# EAGLE design breakout (EAGLE 9.6.2)
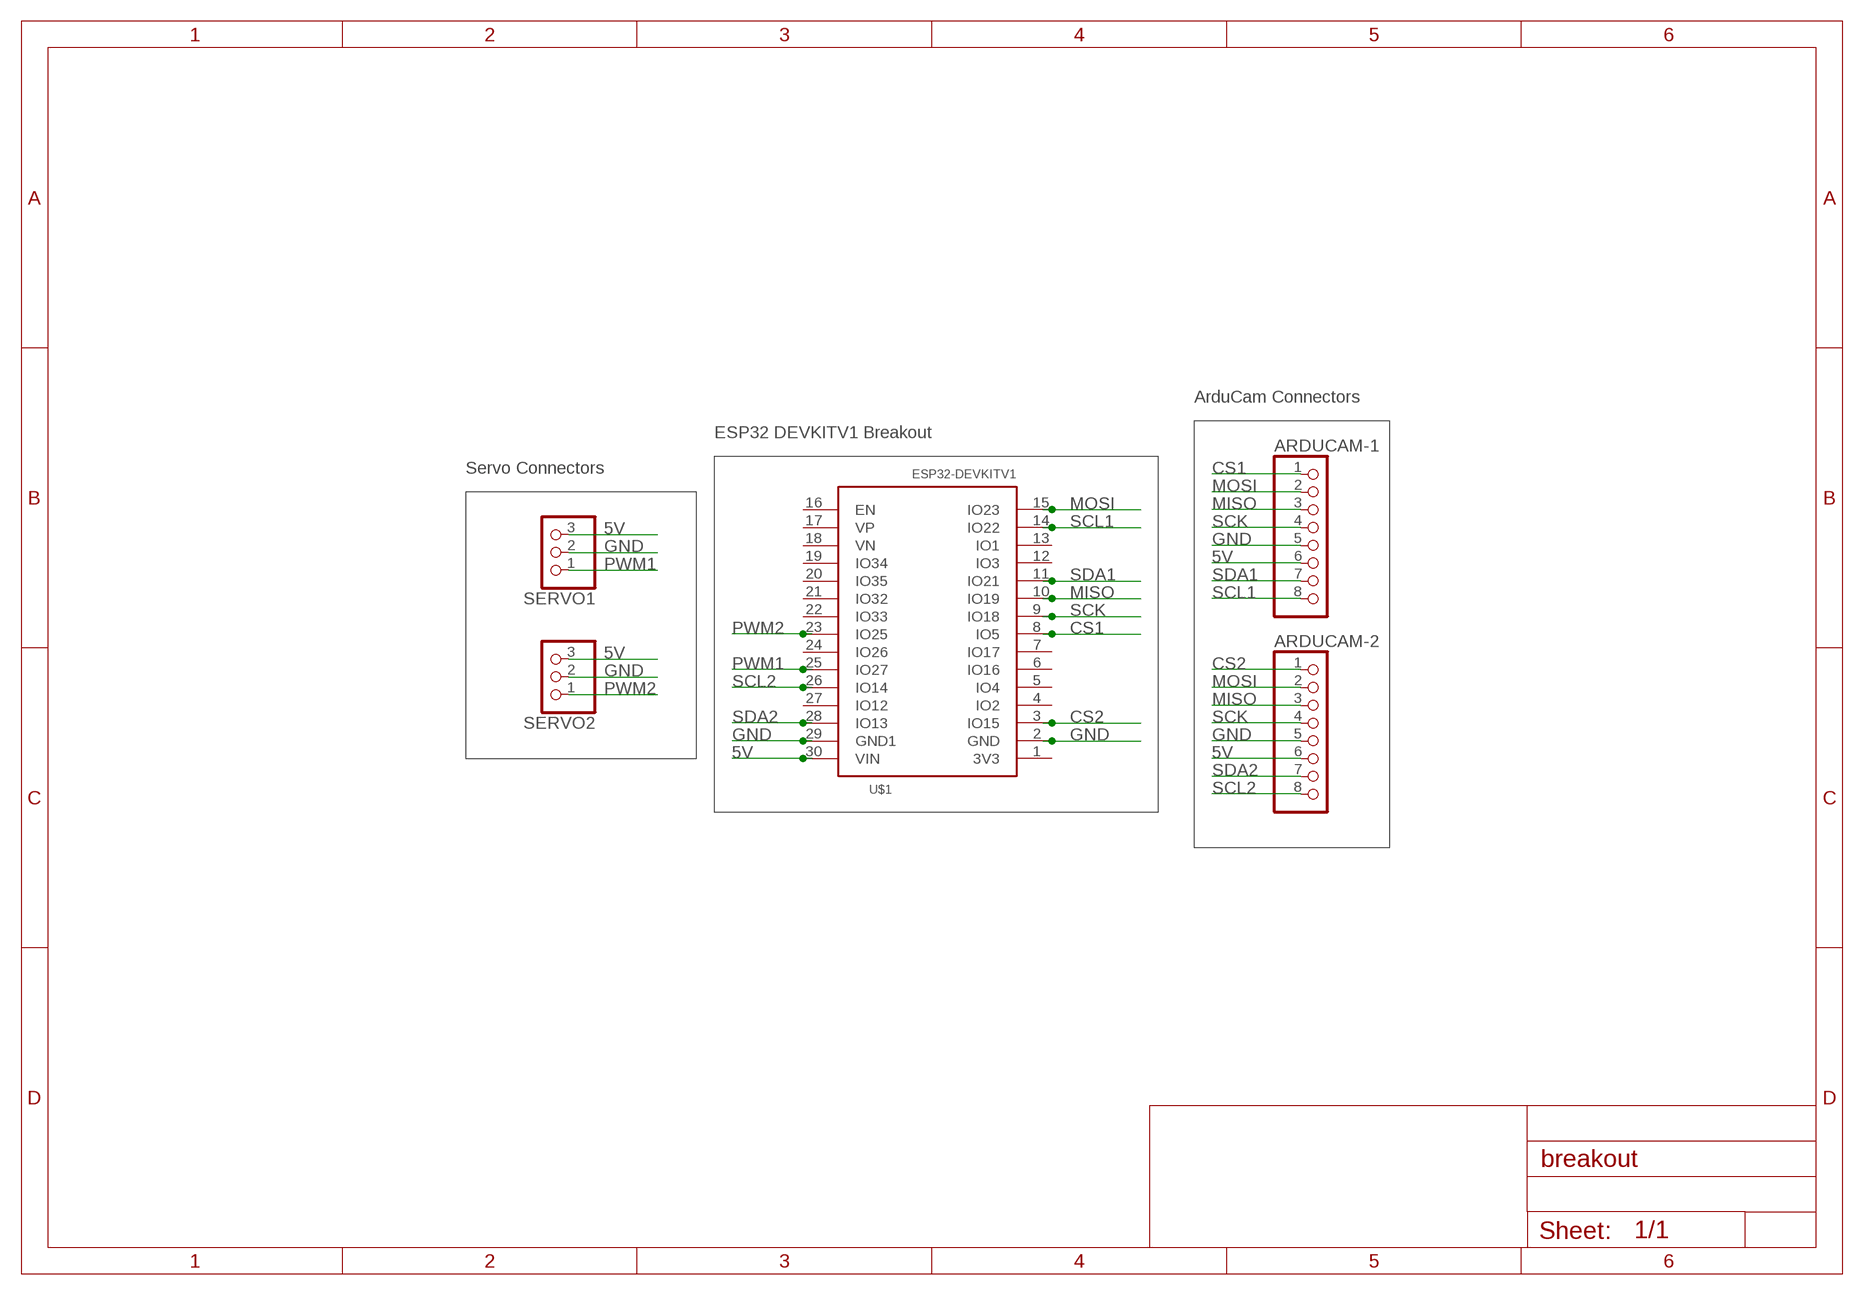
[diagram p0: schematic, sheet 1]

## Parts
ARDUCAM-1  PINHD-1X8BIG  [1X08-BIG]
ARDUCAM-2  PINHD-1X8BIG  [1X08-BIG]
SERVO1  PINHD-1X3  [1X03]
SERVO2  PINHD-1X3  [1X03]
U$1  ESP32DEVKITV1  [ESP32-DEVKITV1]

## Nets
5V: ARDUCAM-1.6 ARDUCAM-2.6 SERVO1.3 SERVO2.3 U$1.30(VIN)
CS1: ARDUCAM-1.1 U$1.8(IO5)
CS2: ARDUCAM-2.1 U$1.3(IO15)
GND: ARDUCAM-1.5 ARDUCAM-2.5 SERVO1.2 SERVO2.2 U$1.2(GND) U$1.29(GND1)
MISO: ARDUCAM-1.3 ARDUCAM-2.3 U$1.10(IO19)
MOSI: ARDUCAM-1.2 ARDUCAM-2.2 U$1.15(IO23)
PWM1: SERVO1.1 U$1.25(IO27)
PWM2: SERVO2.1 U$1.23(IO25)
SCK: ARDUCAM-1.4 ARDUCAM-2.4 U$1.9(IO18)
SCL1: ARDUCAM-1.8 U$1.14(IO22)
SCL2: ARDUCAM-2.8 U$1.26(IO14)
SDA1: ARDUCAM-1.7 U$1.11(IO21)
SDA2: ARDUCAM-2.7 U$1.28(IO13)
Unconnected: U$1.1(3V3) U$1.4(IO2) U$1.5(IO4) U$1.6(IO16) U$1.7(IO17) U$1.12(IO3) U$1.13(IO1) U$1.16(EN) U$1.17(VP) U$1.18(VN) U$1.19(IO34) U$1.20(IO35) U$1.21(IO32) U$1.22(IO33) U$1.24(IO26) U$1.27(IO12)

## Notes on the sheet
- ArduCam Connectors
- ESP32 DEVKITV1 Breakout
- Servo Connectors

## Library data of the parts
ARDUCAM-1 ARDUCAM-2 = adafruit:PINHD-1X8: PIN HEADER
SERVO1 SERVO2 = adafruit:PINHD-1X3: PIN HEADER
U$1 = ESP32-DEVKITV1:ESP32DEVKITV1

## Board
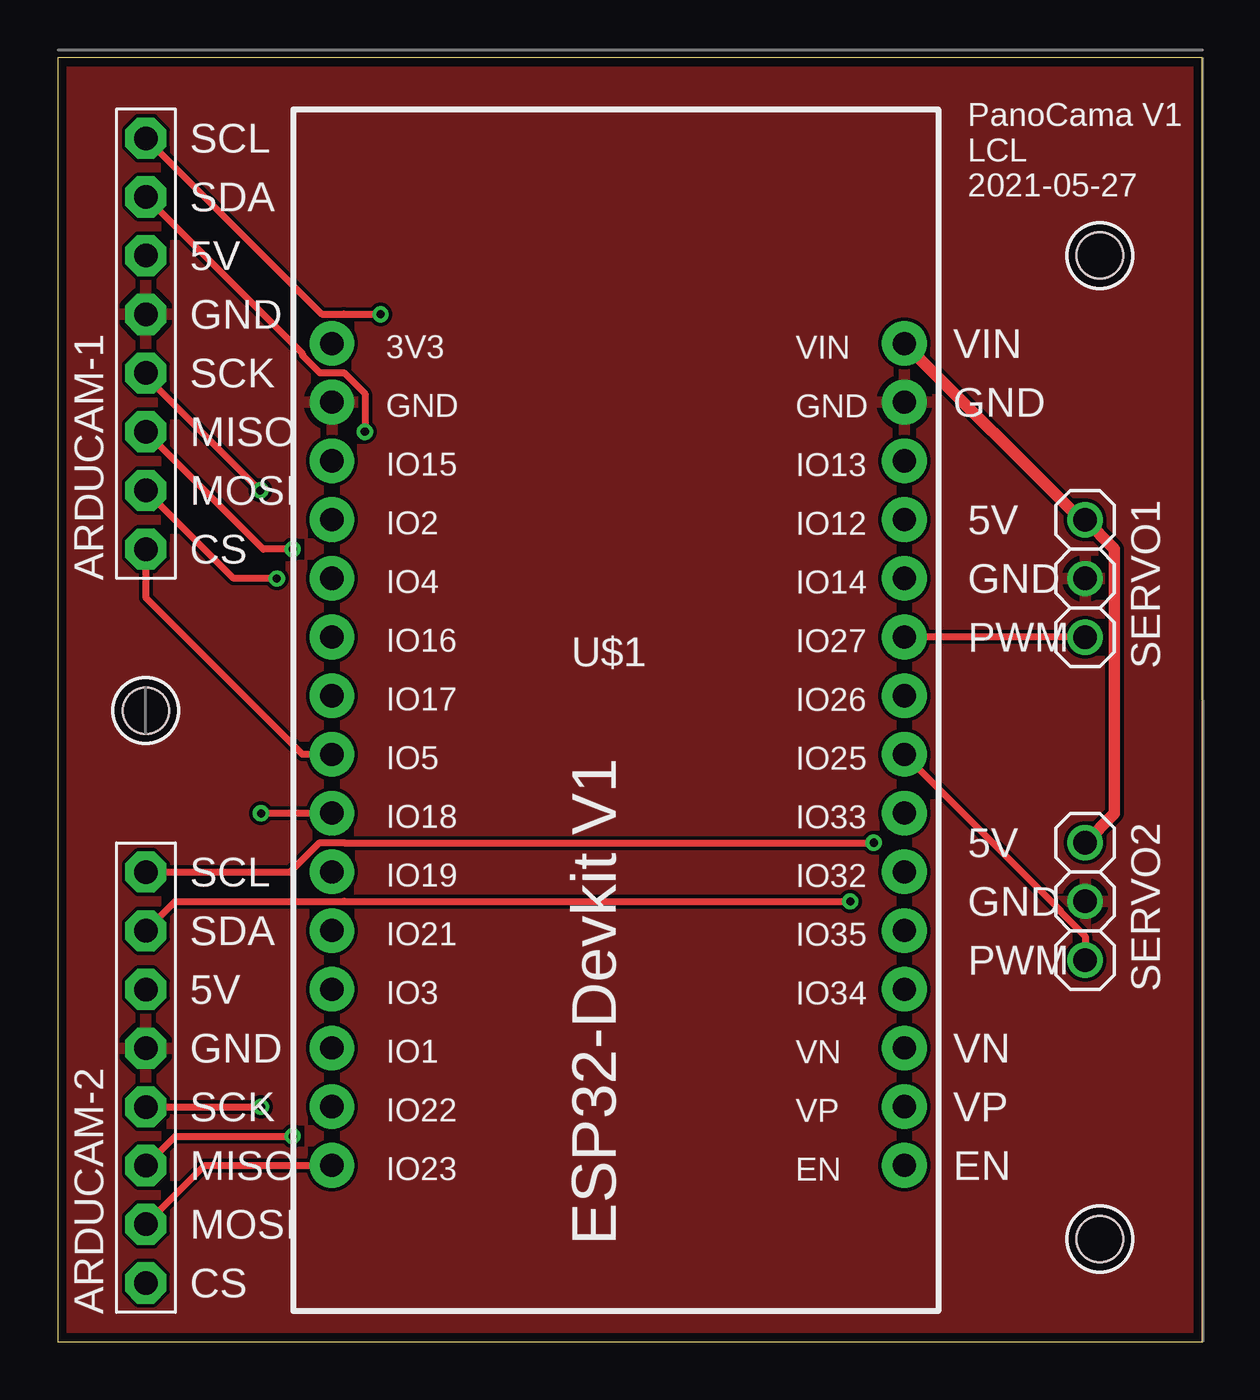
[diagram p1: board, top side]
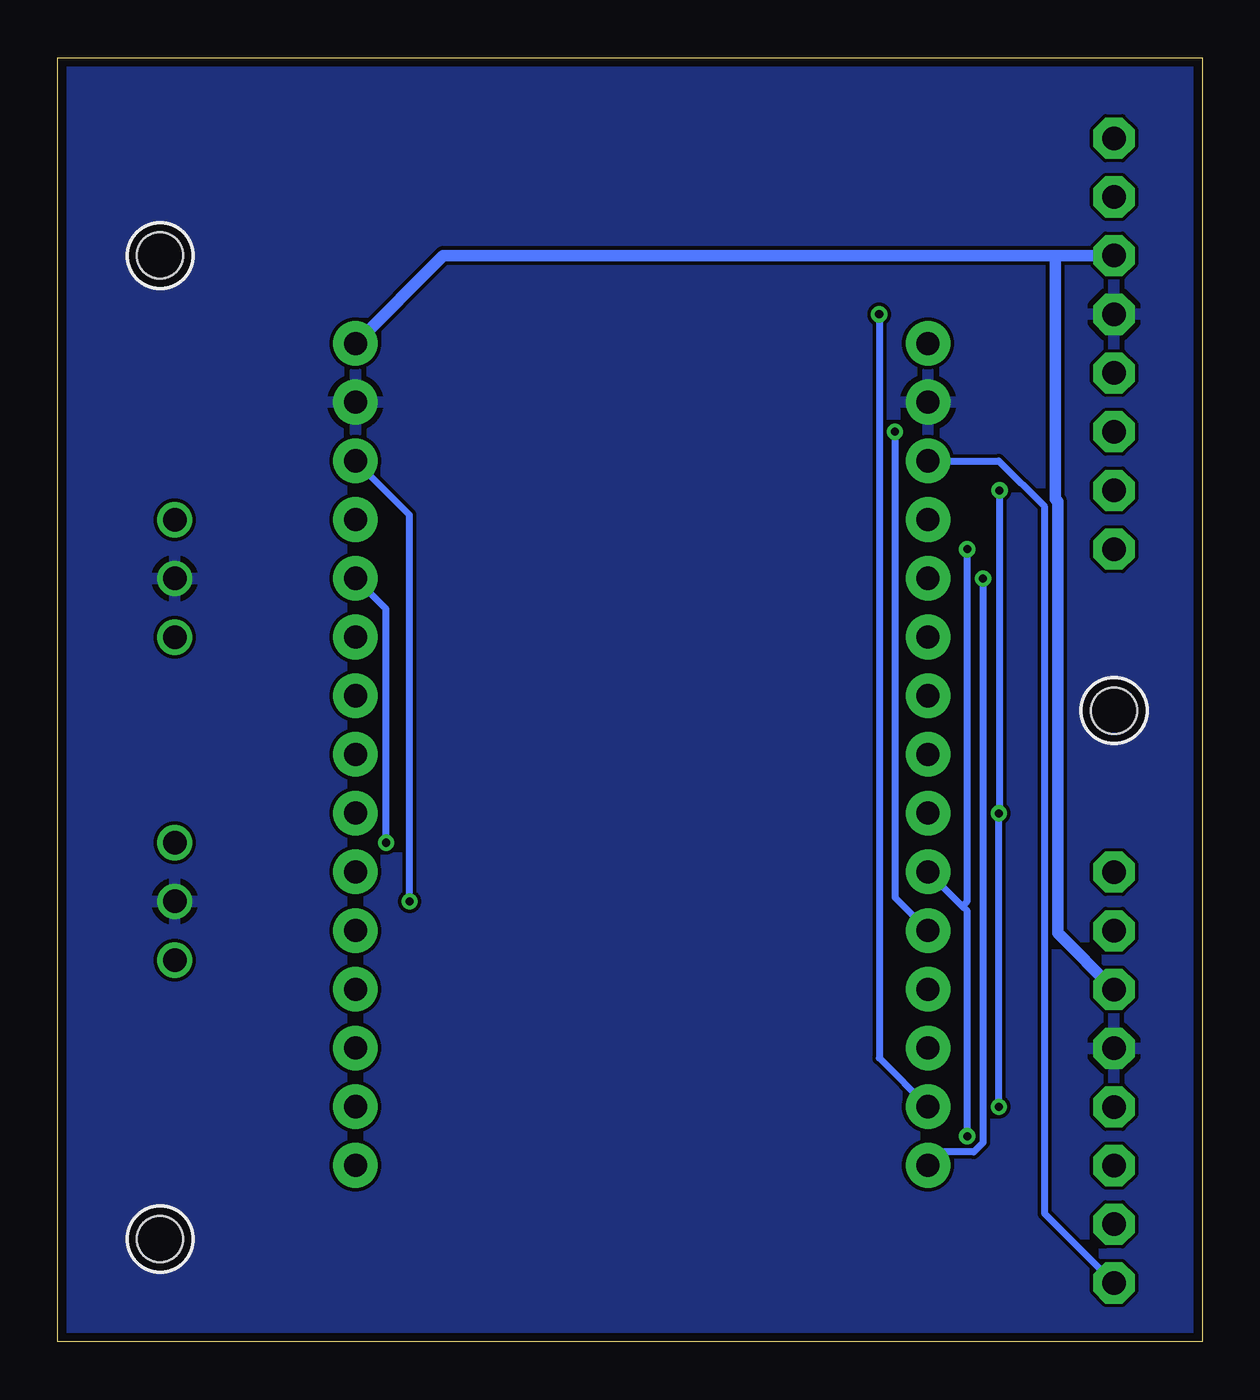
[diagram p2: board, bottom side, seen from below]

Size 49.51 x 55.55 mm. Coordinates in mm from the lower left corner, seen from the top.
Outline: 0,0 49.51,0 49.51,55.55 0,55.55 0,0
Copper layers (1*16): Top 0.0356mm / dielectric 1.5011mm / Bottom 0.0356mm
Design rules "LaenPCBOrder": minimum track width 6mil, minimum drill 13mil, track to track 6mil, track to pad 6mil, pad to pad 6mil, via to via 6mil, smd to smd 6mil, copper to edge 15mil, drill to drill 6mil, minimum pad ring 7mil, minimum via ring 7mil, stop-mask expansion 3mil, vias tented up to drill 0mil, thermal gap 10mil
Holes 2 mm at 45.09,46.99 45.09,4.45 3.81,27.3

### Footprints (pad centres in the part's own frame; a part is rotated, then mirrored left to right if it is on the bottom)
1X08-BIG = drill 1.016 pad 1.778 octagon: 1 -8.89,0; 2 -6.35,0; 3 -3.81,0; 4 -1.27,0; 5 1.27,0; 6 3.81,0; 7 6.35,0; 8 8.89,0
1X03 = drill 1.016: 1 -2.54,0; 2 0,0; 3 2.54,0
ESP32-DEVKITV1 = drill 1 pad 1.93: 1 -22.87,-13.54; 2 -20.33,-13.54; 3 -17.79,-13.54; 4 -15.25,-13.54; 5 -12.71,-13.54; 6 -10.17,-13.54; 7 -7.63,-13.54; 8 -5.09,-13.54; 9 -2.55,-13.54; 10 -0.01,-13.54; 11 2.53,-13.54; 12 5.07,-13.54; 13 7.61,-13.54; 14 10.15,-13.54; 15 12.69,-13.54; 16 12.69,11.23; 17 10.15,11.23; 18 7.61,11.23; 19 5.07,11.23; 20 2.53,11.23; 21 -0.01,11.23; 22 -2.55,11.23; 23 -5.09,11.23; 24 -7.63,11.23; 25 -10.17,11.23; 26 -12.71,11.23; 27 -15.25,11.23; 28 -17.79,11.23; 29 -20.33,11.23; 30 -22.87,11.23

### Placement (x,y rotation side)
ARDUCAM-1  3.81,43.18 90 top
ARDUCAM-2  3.81,11.43 90 top
SERVO1  44.45,33.02 90 top
SERVO2  44.45,19.05 90 top
U$1  25.4,20.32 270 top

### Tracks (layer width: path | path; a pad name or v marks a point on that pad's centre or on a via)
5V
  Top 0.508: SERVO2.3 45.72,22.86 45.72,34.29 SERVO1.3 44.26,35.56 U$1.30
  Bottom 0.508: ARDUCAM-1.6 6.35,46.99 | 6.35,46.99 32.83,46.99 U$1.30 | ARDUCAM-2.6 6.25,17.68 6.25,36.36 6.35,36.46 6.35,46.99
CS1
  Top 0.305: ARDUCAM-1.1 3.81,32.19 10.59,25.41 U$1.8
CS2
  Bottom 0.305: ARDUCAM-2.1 6.81,5.54 6.81,36.13 8.79,38.11 U$1.3
GND
  pour Top: 0,55.88 0,0 49.53,0 49.53,55.88
  pour Bottom: 0,55.24 0,-0.64 49.53,-0.64 49.53,55.88 0.64,55.88
MISO  (via drill 0.35)
  Top 0.305: ARDUCAM-2.3 5.08,8.89 v10.16,8.89 | ARDUCAM-1.3 8.89,34.29 v10.16,34.29
  Bottom 0.305: v10.16,8.89 10.16,18.63 10.37,18.84 | 10.37,18.84 U$1.10 | 10.37,18.84 10.16,19.05 v10.16,34.29
MOSI  (via drill 0.35)
  Top 0.305: ARDUCAM-2.2 6.36,7.63 U$1.15 | v9.48,33.02 7.62,33.02 ARDUCAM-1.2
  Bottom 0.305: U$1.15 11.28,8.21 9.88,8.21 9.48,8.61 v9.48,33.02
PWM1
  Top 0.305: SERVO1.1 U$1.25
PWM2
  Top 0.305: U$1.23 43.38,18.66 43.38,18.61 44.45,17.54 SERVO2.1
SCK  (via drill 0.35)
  Top 0.305: ARDUCAM-2.4 v8.79,10.16 | v8.79,22.86 8.8,22.87 U$1.9 | ARDUCAM-1.4 3.81,41.78 v8.76,36.83
  Bottom 0.305: v8.79,10.16 v8.79,22.86 8.76,22.89 v8.76,36.83
SCL1  (via drill 0.35)
  Top 0.305: ARDUCAM-1.8 11.42,44.46 12.39,44.46 12.4,44.45 v13.97,44.45
  Bottom 0.305: v13.97,44.45 13.97,12.28 U$1.14
SCL2  (via drill 0.35)
  Top 0.305: ARDUCAM-2.8 10.05,20.32 11.33,21.6 12.39,21.6 12.4,21.59 v35.31,21.59
  Bottom 0.305: v35.31,21.59 35.31,31.71 U$1.26
SDA1  (via drill 0.35)
  Top 0.305: ARDUCAM-1.7 10.59,42.75 10.59,42.66 11.33,41.92 12.39,41.92 13.29,41.02 v13.29,39.37
  Bottom 0.305: v13.29,39.37 13.29,19.22 U$1.11
SDA2  (via drill 0.35)
  Top 0.305: v34.29,19.05 12.4,19.05 12.39,19.06 5.09,19.06 ARDUCAM-2.7
  Bottom 0.305: v34.29,19.05 34.29,35.77 U$1.28

### Text on the board
tPlace: SCL | PanoCama V1 / LCL / 2021-05-27 | SDA | 5V | GND | VIN | SCK | GND | MISO | MOSI | 5V | CS | GND | PWM | 5V | SCL | GND | SDA | PWM | 5V | GND | VN | SCK | VP | MISO | EN | MOSI | CS
tDocu: Leo Ling / May 27, 2021 | EE 327: PanoCama ESP32 DevkitV1 board. | This board is a pretty barebones, and more like a breakout board. / A more advanced version with the ESP32 module is in the works.